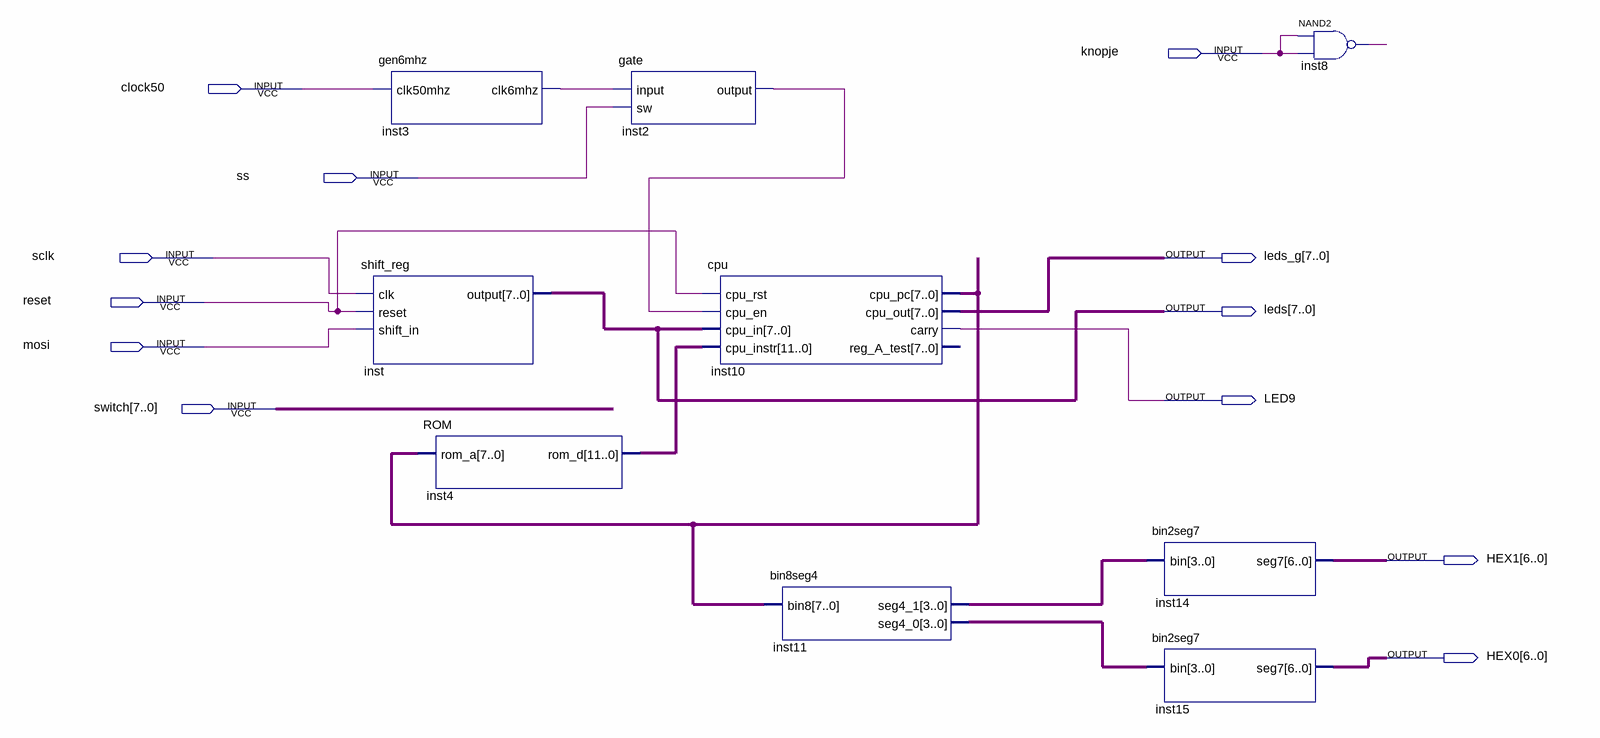
[diagram p0: schematic sheet]
// Quartus schematic top_level_cut.bdf as structural Verilog: 9 symbols, 12 pins
module top_level_cut (
  input  knopje,
  input  clock50,
  input  ss,
  input  sclk,
  input  reset,
  input  mosi,
  input  [7:0] switch,
  output [7:0] leds_g,
  output [7:0] leds,
  output LED9,
  output [6:0] HEX1,
  output [6:0] HEX0
);

  wire inst2_output, inst3_clk6mhz, inst8_out;
  wire [3:0] inst11_seg4_0, inst11_seg4_1;
  wire [7:0] inst10_cpu_pc;
  wire [11:0] inst4_rom_d;

  gen6mhz inst3 (.clk50mhz(clock50), .clk6mhz(inst3_clk6mhz));
  shift_reg inst (.clk(sclk), .reset(reset), .shift_in(mosi), .\output (leds));
  ROM inst4 (.rom_a(inst10_cpu_pc), .rom_d(inst4_rom_d));
  gate inst2 (.\input (inst3_clk6mhz), .sw(ss), .\output (inst2_output));
  cpu inst10 (
    .cpu_rst(reset), .cpu_en(inst2_output), .cpu_in(leds), .cpu_instr(inst4_rom_d), .cpu_pc(inst10_cpu_pc),
    .cpu_out(leds_g), .carry(LED9));  // open: reg_A_test
  bin8seg4 inst11 (.bin8(inst10_cpu_pc), .seg4_1(inst11_seg4_1), .seg4_0(inst11_seg4_0));
  bin2seg7 inst14 (.bin(inst11_seg4_1), .seg7(HEX1));
  bin2seg7 inst15 (.bin(inst11_seg4_0), .seg7(HEX0));
  nand inst8 (inst8_out, knopje, knopje);
endmodule
